# Altium schematic sheet Sheet6.SchDoc
size A
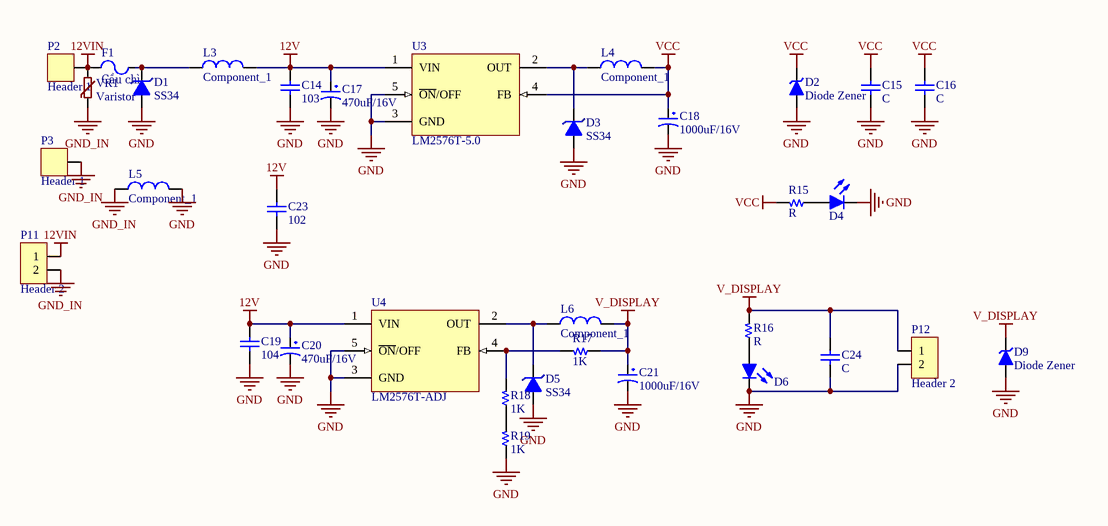
[diagram p0: Sheet6.SchDoc]

## Parts
C14  103  [C 0805]
C15  C  [C 0805]
C16  C  [C 0805]
C17  470uF/16V  [WCAP-PSHP 8x8.7x3.1]
C18  1000uF/16V  [WCAP-PSHP 8x8.7x3.1]
C19  104  [C 0805]
C20  470uF/16V  [WCAP-PSHP 8x8.7x3.1]
C21  1000uF/16V  [WCAP-PSHP 8x8.7x3.1]
C23  102  [C 0805]
C24  C  [C 0805]
D1  SS34  [DO-214AC (SMA)]
D2  Diode Zener  [SOD-80]
D3  SS34  [DO-214AC (SMA)]
D4  Led  [Led 0805 Blue]  (value not drawn)
D5  SS34  [DO-214AC (SMA)]
D6  Led  [Led 0805 Blue]  (value not drawn)
D9  Diode Zener  [SOD-80]
F1  Cầu chì  [DCAR Fuse holder]
L3  Component_1  [1210]
L4  Component_1  [1210]
L5  Component_1  [1210]
L6  Component_1  [1210]
P2  Header 1  [HDR/Terminal/1/copper/8.8]
P3  Header 1  [HDR/Terminal/1/copper/8.8]
P11  Header 2  [HDR Domino 2]
P12  Header 2  [CON Header 2]
R15  R  [R 0805]
R16  R  [R 0805]
R17  1K  [R 0805]
R18  1K  [R 0805]
R19  1K  [R 0805]
U3  LM2576T-5.0  [D2-PACK5]
U4  LM2576T-ADJ  [D2-PACK5]
VR1  Varistor  [VARISTOR DISC 5MM/7MM]

## Nets
12V: C14.1 C17.1 C19.1 C20.1 C23.1 L3.2 U3.1(VIN) U4.1(VIN)
12VIN: F1.1 P2.1 P11.1 VR1.1
GND: C14.2 C15.2 C16.2 C17.2 C18.2 C19.2 C20.2 C21.2 C23.2 C24.2 D1.1(A) D2.1(A) D3.1(A) D4.2(K) D5.1(A) D6.2(K) D9.1(A) L5.2 P12.2 R19.1 U3.3(GND) U3.5(~{ON}/OFF) U4.3(GND) U4.5(~{ON}/OFF)
GND_IN: L5.1 P3.1 P11.2 VR1.2
V_DISPLAY: C21.1 C24.1 D9.2(K) L6.2 P12.1 R16.2 R17.1
VCC: C15.1 C16.1 C18.1 D2.2(K) L4.2 R15.2 U3.4(FB)
NetD1_2: D1.2(K) F1.2 L3.1
NetD3_2: D3.2(K) L4.1 U3.2(OUT)
NetD4_1: D4.1(A) R15.1
NetD5_2: D5.2(K) L6.1 U4.2(OUT)
NetD6_1: D6.1(A) R16.1
NetR17_2: R17.2 R18.2 U4.4(FB)
NetR18_1: R18.1 R19.2

## Library data of the parts
C14-C16 C19 C23 C24 = Capacitor NP: Capacitor non-pol
C17 C20 = CP3: Cap 100uF/35V - 470uF/16V; Value: 100uF/35V/50V; Description 1: 1000uF/6,3V - 470uF/16V - 330uF - 25V; Description 2: 220uF/35V - 100uF/50V - 63V - 4,7uF/200V; Description 3: 22uF => 33uF100V - 3,3uF => 4,7uF/250V; Description 4: 2,2uF =>3,3uF/350 - 2,2uF/400V - 1uF/450V
C18 C21 = CP4: Cap 1000uF/16V - 220uF/50V; Description 5: 4,7uF>10uF/250V_3,3uF>10uF/400V - 2,2uF>4,7uF/450V; Description 1: 2200uF-3300uF/6,3V - 1000uF-2200uF/10V; Description 2: 1000uF/16V - 470uF => 1000uF/25V - 100uF/100V; Description 3: 330uF>470uF/35V_220uF>470uF/50V_10uF>22uF/250V; Description 4: 220uF => 330uF/63V - 10uF =>33uF/160 - 200V; Value: 1000uF/16V
D1 D3 D5 = Zener
D2 D9 = Diode Zener: Zener Diode; Published: 8-Jun-2000; LatestRevisionDate: 17-Jul-2002; LatestRevisionNote: Re-released for DXP Platform.; PackageReference: DIODE-0.7; Publisher: Altium Limited
D4 D6 = Led: Typical LED
F1 = Fuse
P2 P3 = Header 1: Header, 1-Pin
P11 P12 = Header 2: Header, 2-Pin; LatestRevisionDate: 17-Jul-2002; LatestRevisionNote: Re-released for DXP Platform.; Publisher: Altium Limited
R15-R19 = Resistor
U3 U4 = LM2576T-5.0: SIMPLE SWITCHER; 3A Step-Down Voltage Regulator; Manufacturer: National Semiconductor; PackageTopMarking: NSUZXYTT*LM2576T*-5.0 P+; PowerWise: N; FirstPublished: 4-Dec-2008; DatasheetVersion: Aug-2004; PackageVersion: revJ, Jan-1992; PackageReference: T05A; Publisher: Altium Limited; PackageDescription: TO-220, Molded, 5 Lead, Straight; CompType: Switcher; PartNumber: LM2576T-5.0; RoHS: O; PinCount: 5; DigiKeyPartNumber: LM2576T-5.0-ND; Code_JEDEC: TO-220-AB; ComponentLink1Description: LM2576 Datasheet; ComponentLink1URL: http://www.national.com/ds/LM/LM2576.pdf; ComponentLink2Description: LM2576 Web Page; ComponentLink2URL: http://www.national.com/pf/LM/LM2576.html; ComponentLink3Description: T05A Package Page; ComponentLink3URL: http://www.national.com/packaging/folders/t05a.html